# EAGLE design nunchuckUSB-v13 (EAGLE 5.10)
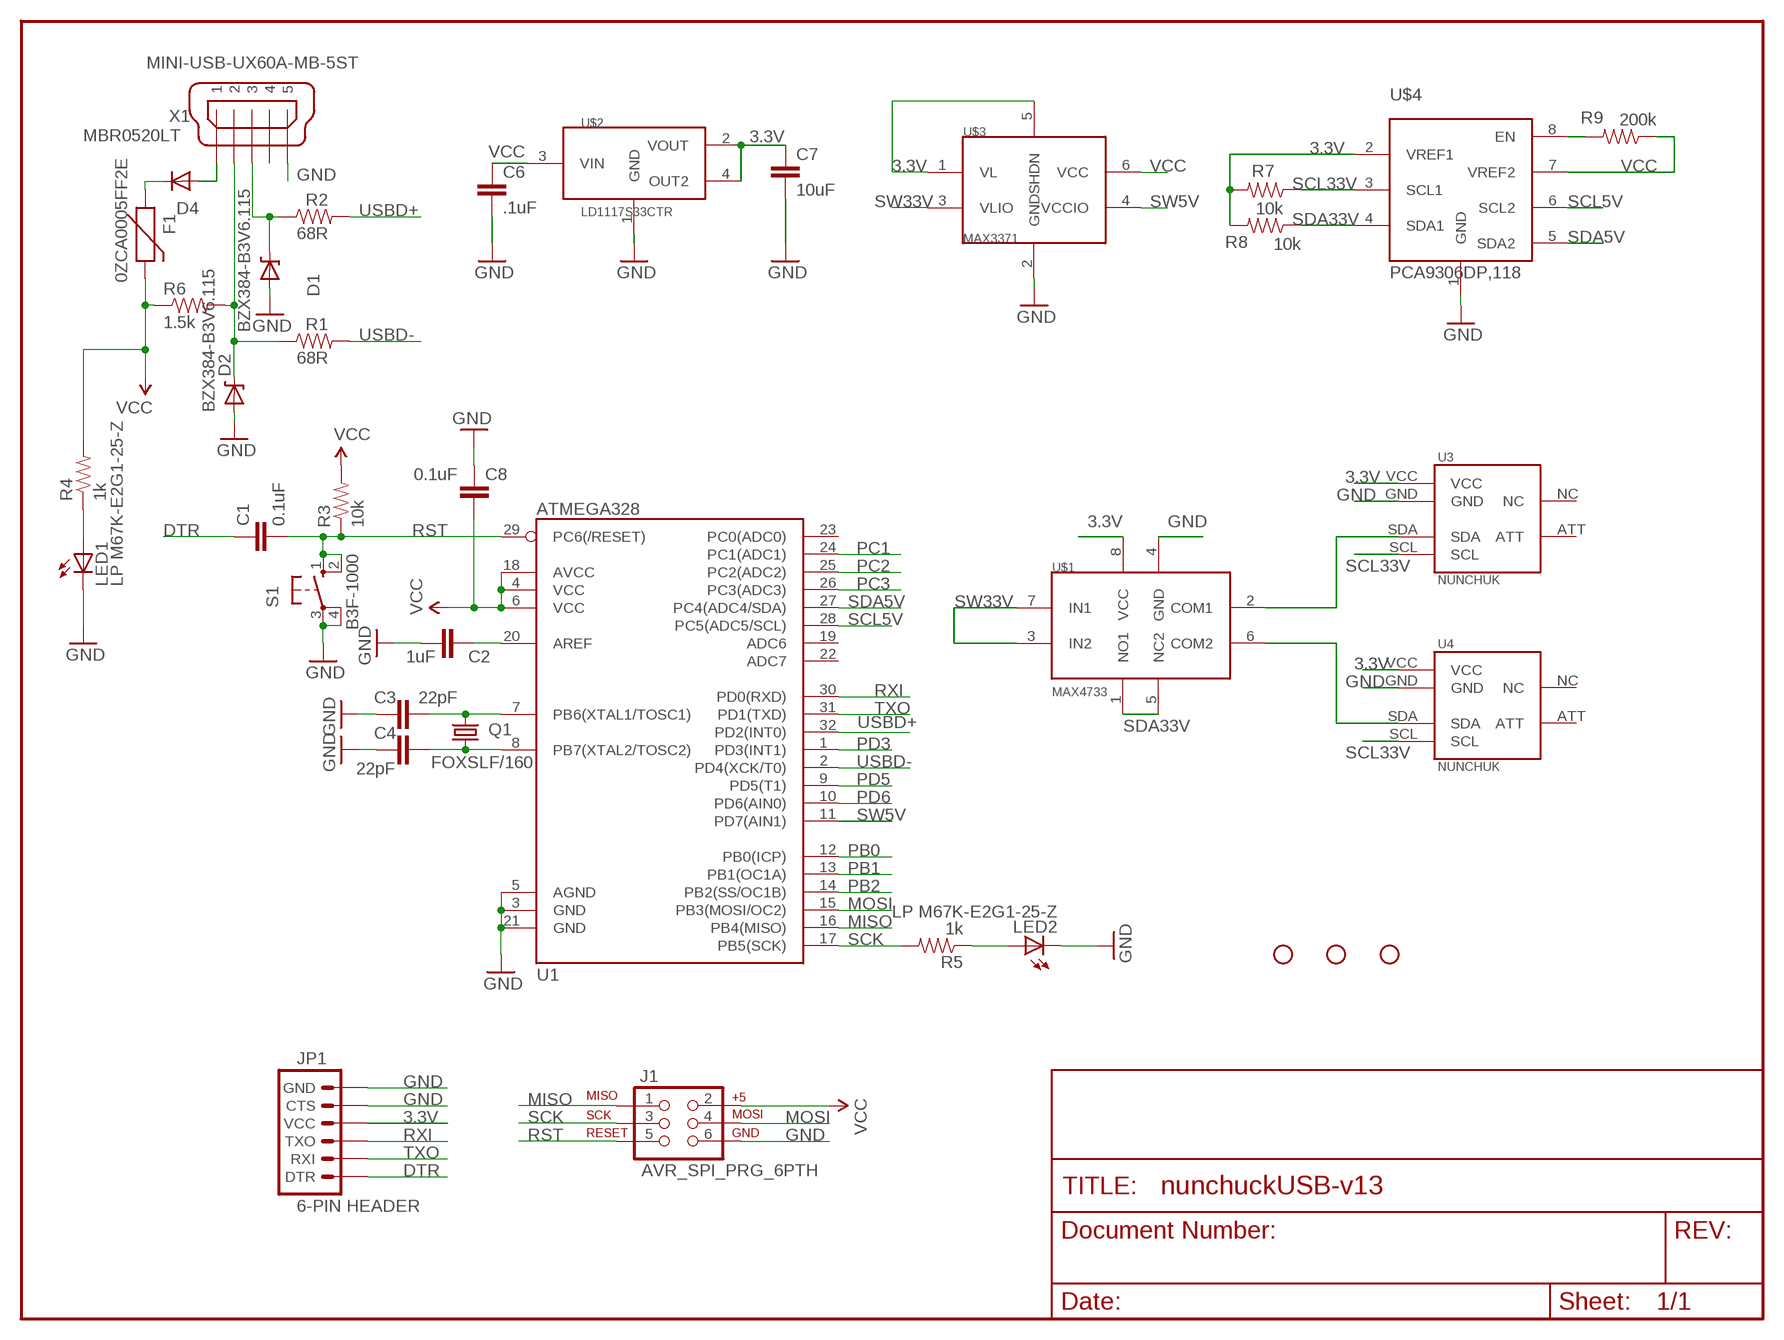
[diagram p0: schematic, sheet 1]

## Parts
C1  0.1uF  CAP0805  [0805]
C2  1uF  CAP0805  [0805]
C3  22pF  CAP0805  [0805]
C4  22pF  CAP0805  [0805]
C6  .1uF  CAP0805  [0805]
C7  10uF  CAP0805  [0805]
C8  0.1uF  CAP0805  [0805]
D1  BZX384-B3V6.115  DIODE-ZENER-BZT52  [SOD-323]
D2  BZX384-B3V6.115  DIODE-ZENER-BZT52  [SOD-323]
D4  MBR0520LT  [SOD123]
F1  0ZCA0005FF2E  PTCSMD  [PTC-1206]
J1  AVR_SPI_PRG_6PTH  [2X3]
JP1  6-PIN HEADER  ARDUINO_SERIAL_PROGRAMPTH  [1X06]
JP2  STAND-OFF  [STAND-OFF]
JP4  STAND-OFF  [STAND-OFF]
JP5  STAND-OFF  [STAND-OFF]
LED1  LP M67K-E2G1-25-Z  LEDCHIPLED_0805  [CHIPLED_0805]
LED2  LP M67K-E2G1-25-Z  LEDCHIPLED_0805  [CHIPLED_0805]
Q1  FOXSLF/160  CRYSTALHC49US  [HC49US]
R1  68R  RESISTOR  [0805]
R2  68R  RESISTOR  [0805]
R3  10k  RESISTOR  [0805]
R4  1k  RESISTOR  [0805]
R5  1k  RESISTOR  [0805]
R6  1.5k  RESISTOR  [0805]
R7  10k  RESISTOR  [0805]
R8  10k  RESISTOR  [0805]
R9  200k  RESISTOR  [0805]
S1  B3F-1000  10-XX  [B3F-10XX]
U1  ATMEGA328  ATMEGA168  [TQFP32-08]
U3  NUNCHUK  [NUNCHUK-TERMINAL]
U4  NUNCHUK  [NUNCHUK-TERMINAL]
U$1  MAX4733  [MSOP8]
U$2  LD1117S33CTR  [SOT223]
U$3  MAX3371  [SC70-6L]
U$4  PCA9306DP,118  [TSSOP8]
X1  MINI-USB-UX60A-MB-5ST  [UX60A-MB-5ST]

## Nets
3.3V: C7.1 JP1.4(VCC) R7.2 R8.2 U3.VCC U4.VCC U$1.8(VCC) U$2.2(VOUT) U$2.4(OUT2) U$3.1(VL) U$3.5(SHDN) U$4.2(VREF1)
DTR: C1.1 JP1.1(DTR)
GND: C2.2 C3.1 C4.1 C6.2 C7.2 C8.1 D1.2(A) D2.2(A) J1.6 JP1.5(CTS) JP1.6(GND) LED1.C LED2.C S1.3(P) S1.4(P1) U1.3(GND) U1.5(AGND) U1.21(GND) U3.GND U4.GND U$1.4(GND) U$2.1(GND) U$3.2(GND) U$4.1(GND) X1.5
MISO: J1.1 U1.16(PB4(MISO))
MOSI: J1.4 U1.15(PB3(MOSI/OC2))
N$1: D4.C F1.1
N$2: C2.1 U1.20(AREF)
N$3: D2.1(C) R1.1 R6.2 X1.2
N$4: D1.1(C) R2.1 X1.3
N$5: C3.2 Q1.2 U1.7(PB6(XTAL1/TOSC1))
N$6: C4.2 Q1.1 U1.8(PB7(XTAL2/TOSC2))
N$7: LED1.A R4.1
N$8: D4.A X1.1
N$9: LED2.A R5.1
N$10: R9.2 U$4.8(EN)
N$16: U3.SDA U$1.2(COM1)
N$17: U4.SDA U$1.6(COM2)
PB0: U1.12(PB0(ICP))
PB1: U1.13(PB1(OC1A))
PB2: U1.14(PB2(SS/OC1B))
PC1: U1.24(PC1(ADC1))
PC2: U1.25(PC2(ADC2))
PC3: U1.26(PC3(ADC3))
PD3: U1.1(PD3(INT1))
PD5: U1.9(PD5(T1))
PD6: U1.10(PD6(AIN0))
RST: C1.2 J1.5 R3.1 S1.1(S) S1.2(S1) U1.29(PC6(/RESET))
RXI: JP1.3(TXO) U1.30(PD0(RXD))
SCK: J1.3 R5.2 U1.17(PB5(SCK))
SCL5V: U1.28(PC5(ADC5/SCL)) U$4.6(SCL2)
SCL33V: R7.1 U3.SCL U4.SCL U$4.3(SCL1)
SDA5V: U1.27(PC4(ADC4/SDA)) U$4.5(SDA2)
SDA33V: R8.1 U$1.1(NO1) U$1.5(NC2) U$4.4(SDA1)
SW5V: U1.11(PD7(AIN1)) U$3.4(VCCIO)
SW33V: U$1.3(IN2) U$1.7(IN1) U$3.3(VLIO)
TXO: JP1.2(RXI) U1.31(PD1(TXD))
USBD+: R2.2 U1.32(PD2(INT0))
USBD-: R1.2 U1.2(PD4(XCK/T0))
VCC: C6.1 C8.2 F1.2 J1.2 R3.2 R4.2 R6.1 R9.1 U1.4(VCC) U1.6(VCC) U1.18(AVCC) U$2.3(VIN) U$3.6(VCC) U$4.7(VREF2)
Unconnected: U1.19(ADC6) U1.22(ADC7) U1.23(PC0(ADC0)) U3.ATT U3.NC U4.ATT U4.NC X1.4

## Library data of the parts
C1-C4 C6-C8 = SparkFun:CAP: Capacitor Standard 0603 ceramic capacitor, and 0.1" leaded capacitor.
D1 D2 = SparkFun:DIODE-ZENER: Zener Diode Production Part - 8199 3.4V Zener Voltage
D4 = diode:MBR0520LT: SCHOTTKY BARRIER RECTIFIER Source: http://onsemi.com .. MBR0520LT1-D.pdf
F1 = SparkFun:PTC: Resettable Fuse PTC Resettable Fuse. Spark Fun Electronics SKU : COM-08357
J1 = SparkFun:AVR_SPI_PRG_6: AVR ISP 6 Pin This is the reduced ISP connector for AVR programming. Common on Arduino. This footprint will take up less PCB space and can be used with a 10-pin to 6-pin adapter such as SKU: BOB-08508
JP1 = SparkFun:ARDUINO_SERIAL_PROGRAM
JP2 JP4 JP5 = SparkFun:STAND-OFF: Stand Off This is the mechanical footprint for a #4 phillips button head screw. Use the keepout ring to avoid running the screw head into surrounding components. SKU : PRT-00447
LED1 LED2 = led:LED: LED OSRAM: - CHIPLED LG R971, LG N971, LY N971, LG Q971, LY Q971, LO R971, LY R971 LH N974, LH R974 LS Q976, LO Q976, LY Q976 LO Q996 - Hyper CHIPLED LW Q18S LB Q993, LB Q99A, LB R99A - SideLED LS A670, LO A670, LY A670, LG A670, LP A670 LB A673, LV A673, LT A673, LW A673 LH A674 LY A675 LS A676, LA A676, LO A676, LY A676, LW A676 LS A679, LY A679, LG A679 - Hyper Micro SIDELED® LS Y876, LA Y876, LO Y876, LY Y876 LT Y87S - SmartLED LW L88C, LW L88S LB L89C, LB L89S, LG L890 LS L89K, LO L89K, LY L89K LS L896, LA L896, LO L896, LY L896 - TOPLED LS T670, LO T670, LY T670, LG T670, LP T670 LSG T670, LSP T670, LSY T670, LOP T670, LYG T670 LG T671, LOG T671, LSG T671 LB T673, LV T673, LT T673, LW T673 LH T674 LS T676, LA T676, LO T676, LY T676, LB T676, LH T676, LSB T676, LW T676 LB T67C, LV T67C, LT T67C, LS T67K, LO T67K, LY T67K, LW E67C LS E67B, LA E67B, LO E67B, LY E67B, LB E67C, LV E67C, LT E67C LW T67C LS T679, LY T679, LG T679 LS T770, LO T770, LY T770, LG T770, LP T770 LB T773, LV T773, LT T773, LW T773 LH T774 LS E675, LA E675, LY E675, LS T675 LS T776, LA T776, LO T776, LY T776, LB T776 LHGB T686 LT T68C, LB T68C - Hyper Mini TOPLED® LB M676 - Mini TOPLED Santana® LG M470 LS M47K, LO M47K, LY M47K Source: http://www.osram.convergy.de LUXEON: - LUMILED® LXK2-PW12-R00, LXK2-PW12-S00, LXK2-PW14-U00, LXK2-PW14-V00 LXK2-PM12-R00, LXK2-PM12-S00, LXK2-PM14-U00 LXK2-PE12-Q00, LXK2-PE12-R00, LXK2-PE12-S00, LXK2-PE14-T00, LXK2-PE14-U00 LXK2-PB12-K00, LXK2-PB12-L00, LXK2-PB12-M00, LXK2-PB14-N00, LXK2-PB14-P00, LXK2-PB14-Q00 LXK2-PR12-L00, LXK2-PR12-M00, LXK2-PR14-Q00, LXK2-PR14-R00 LXK2-PD12-Q00, LXK2-PD12-R00, LXK2-PD12-S00 LXK2-PH12-R00, LXK2-PH12-S00 LXK2-PL12-P00, LXK2-PL12-Q00, LXK2-PL12-R00 Source: www.luxeon.com KINGBRIGHT: KA-3528ASYC Source: www.kingbright.com
Q1 = SparkFun:CRYSTAL: Crystals Various standard crystals. Proven footprints. Spark Fun Electronics SKU : COM-00534
R1-R9 = SparkFun:RESISTOR: Resistor Basic schematic elements and footprints for 0603, 1206, and PTH 1/10th watt (small) resistors.
S1 = switch-omron:10-XX: OMRON SWITCH
U1 = SparkFun:ATMEGA168
U3 U4 = DSanchez:NUNCHUK
U$1 = DSanchez:MAX4733
U$2 = DSanchez:LD1117S33CTR
U$3 = DSanchez:MAX3371
U$4 = DSanchez:PCA9306DP,118
X1 = con-hirose:MINI-USB-: MINI USB Connector Source: http://www.hirose.co.jp/cataloge_hp/e24000019.pdf

## Board
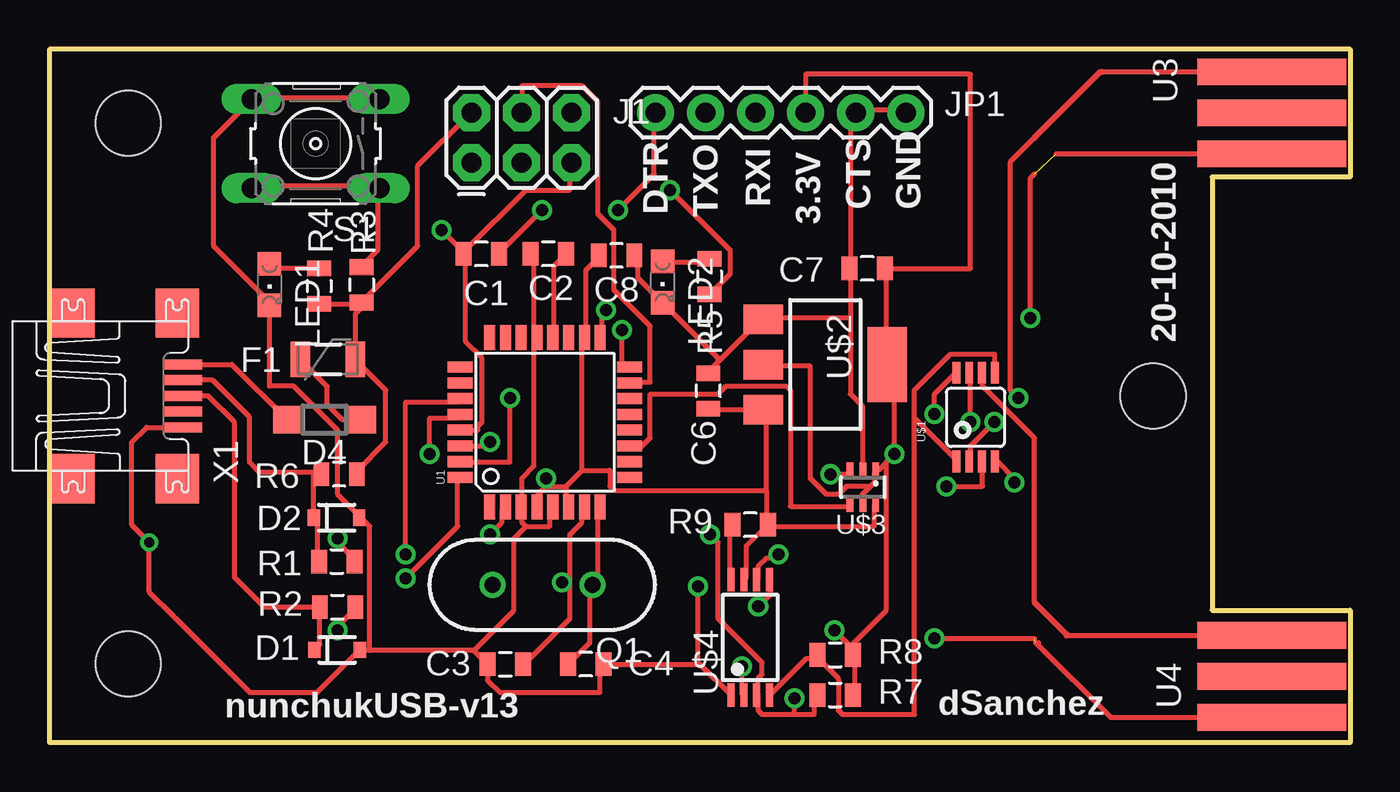
[diagram p1: board, top side]
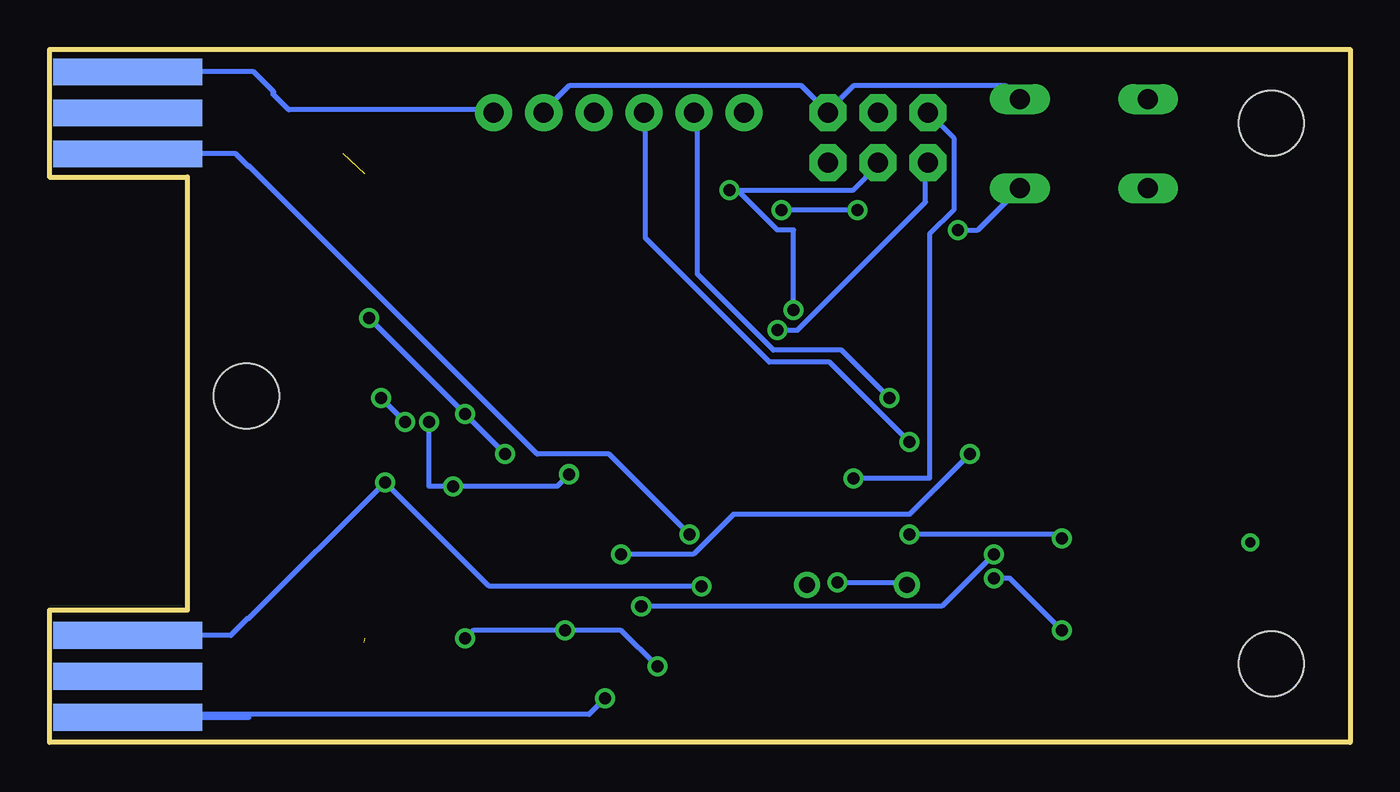
[diagram p2: board, bottom side, seen from below]

Size 66 x 35.18 mm. Coordinates in mm from the lower left corner, seen from the top.
Outline: 0,0 66,0 66,6.71 59,6.71 59,28.7 66,28.7 66,35.18 0,35.18 0,0
Copper layers (1*16): Top 0.035mm / dielectric 1.5mm / Bottom 0.035mm
Design rules "default": minimum track width 10mil, minimum drill 24mil, track to track 8mil, track to pad 8mil, pad to pad 8mil, via to via 8mil, smd to smd 8mil, copper to edge 40mil, drill to drill 8mil, minimum pad ring 10mil, minimum via ring 8mil, stop-mask expansion 4mil, vias tented up to drill 0mil, thermal gap 10mil

### Footprints (pad centres in the part's own frame; a part is rotated, then mirrored left to right if it is on the bottom)
0805 = smd 0.8 x 1.2: 1 -0.9,0; 2 0.9,0
SOD-323 = smd 0.63 x 0.83: 1 -1.15,0; 2 1.15,0
SOD123 = smd 1.4 x 1.4: A 1.9,0; C -1.9,0
PTC-1206 = smd 1 x 1.8: 1 -1.4,0; 2 1.4,0
2X3 = drill 1.016 pad 1.88 octagon: 1 0,0; 2 0,2.54; 3 2.54,0; 4 2.54,2.54; 5 5.08,0; 6 5.08,2.54
1X06 = drill 1.016 pad 1.88 round: 1 0,0; 2 2.54,0; 3 5.08,0; 4 7.62,0; 5 10.16,0; 6 12.7,0
STAND-OFF = hole 3.302: 0,0
CHIPLED_0805 = smd 1.2 x 1.2: A 0,-1.05; C 0,1.05
HC49US = drill 0.813 round: 1 -2.54,0; 2 2.54,0
B3F-10XX = drill 1.016 long: 1 -3.251,2.261; 2 3.251,2.261; 3 -3.251,-2.261; 4 3.251,-2.261
TQFP32-08 = smd 1.27 x 0.559: 1 -4.293,2.8; 2 -4.293,2; 3 -4.293,1.2; 4 -4.293,0.4; 5 -4.293,-0.4; 6 -4.293,-1.2; 7 -4.293,-2; 8 -4.293,-2.8; 17 4.293,-2.8; 18 4.293,-2; 19 4.293,-1.2; 20 4.293,-0.4; 21 4.293,0.4; 22 4.293,1.2; 23 4.293,2; 24 4.293,2.8 | smd 0.559 x 1.27: 9 -2.8,-4.293; 10 -2,-4.293; 11 -1.2,-4.293; 12 -0.4,-4.293; 13 0.4,-4.293; 14 1.2,-4.293; 15 2,-4.293; 16 2.8,-4.293; 25 2.8,4.293; 26 2,4.293; 27 1.2,4.293; 28 0.4,4.293; 29 -0.4,4.293; 30 -1.2,4.293; 31 -2,4.293; 32 -2.8,4.293
NUNCHUK-TERMINAL = smd 7.56 x 1.36: ATT -3.78,0; SDA -3.78,2.08; VCC -3.78,-2.08 | smd 7.56 x 1.36 bottom: GND -3.78,2.08; NC -3.78,0; SCL -3.78,-2.08
MSOP8 = smd 0.4 x 1.1: 1 -0.975,-2.25; 2 -0.325,-2.25; 3 0.325,-2.25; 4 0.975,-2.25; 5 0.975,2.25; 6 0.325,2.25; 7 -0.325,2.25; 8 -0.975,2.25
SOT223 = smd 1.5 x 2: 1 -2.3,-3.15; 2 0,-3.15; 3 2.3,-3.15 | smd 3.8 x 2: 4 0,3.15
SC70-6L = smd 0.35 x 0.8: 1 -0.65,-0.85; 2 0,-0.85; 3 0.65,-0.85; 4 0.65,0.85; 5 0,0.85; 6 -0.65,0.85
TSSOP8 = smd 1.2 x 0.35: 1 -2.925,0.975; 2 -2.925,0.325; 3 -2.925,-0.325; 4 -2.925,-0.975; 5 2.925,-0.975; 6 2.925,-0.325; 7 2.925,0.325; 8 2.925,0.975
UX60A-MB-5ST = smd 2 x 0.5: 1 2.25,1.6; 2 2.25,0.8; 3 2.25,0; 4 2.25,-0.8; 5 2.25,-1.6 | smd 2.2 x 2.5: M1 -3.3,-4.2; M2 -3.3,4.2; M3 2,4.2; M4 2,-4.2

### Placement (x,y rotation side)
C1  21.91,24.79 180 top
C2  25.32,24.8 180 top
C3  23.13,3.97 0 top
C4  27.21,3.97 180 top
C6  33.43,17.84 90 top
C7  41.49,24.06 180 top
C8  28.78,24.72 180 top
D1  14.61,4.7 0 top
D2  14.57,11.41 0 top
D4  13.97,16.38 180 top
F1  14.13,19.44 0 top
J1  21.42,29.42 0 top
JP1  30.75,31.96 0 top
JP2  56,17.59 0 top
JP4  4,31.43 0 top
JP5  4,4 0 top
LED1  11.18,23.24 180 top
LED2  31.11,23.37 180 top
Q1  25.02,8 180 top
R1  14.59,9.18 0 top
R2  14.62,6.87 0 top
R3  15.85,23.22 270 top
R4  13.69,23.16 270 top
R5  33.49,23.64 270 top
R6  14.71,13.62 180 top
R7  39.88,2.41 0 top
R8  39.88,4.45 0 top
R9  35.56,11.05 180 top
S1  13.51,30.39 180 top
U1  25.14,16.25 90 top
U3  65.8,31.95 0 top
U4  65.8,3.35 0 top
U$1  46.99,16.51 0 top
U$2  39.37,19.18 270 top
U$3  41.27,12.95 180 top
U$4  35.56,5.33 90 top
X1  4.5,17.59 0 top

### Tracks (layer width: path | path; a pad name or v marks a point on that pad's centre or on a via)
3.3V  (via drill 0.61)  (2 unrouted)
  Top 0.254: U4.VCC 54.61,1.27 53.85,1.27 50.11,5 | 51.09,29.87 U3.VCC | 50.11,5 50.04,5.08 | 50.11,5 50.19,5.08 | v35.15,3.86 35.15,2.44 U$4.2 | v39.83,5.69 40.64,4.88 | 40.64,4.88 40.64,4.47 R8.2 | R7.2 40.84,2.44 40.84,4.27 R8.2 | v44.91,5.28 49.99,5.28 | 41.66,13.01 41.86,13.21 41.86,13.61 U$3.1 42.06,13.82 42.47,14.22 | 41.66,13.01 41.25,12.6 41.25,12.19 U$3.5 | v44.91,16.66 44.91,17.68 45.92,18.69 U$1.8 | 42.47,14.22 v42.88,14.63 42.88,18.9 42.67,19.1 U$2.4 42.47,19.3 42.47,23.98 C7.1 46.74,24.06 46.74,33.91 38.37,33.91 JP1.4 | 41.66,13.01 40.44,13.01 40.03,12.6 39.42,12.6 38.61,13.41 38.61,19.1 36.37,19.1 U$2.2 | 40.64,4.88 42.47,6.71 42.47,14.22 | 40.64,4.88 R8.2 | 49.99,28.85 49.78,28.65 v49.78,21.54
  Bottom 0.254: v35.15,3.86 36.98,5.69 v39.83,5.69 44.5,5.69 v44.91,5.28 | v42.88,14.63 v44.91,16.66 v49.78,21.54
DTR  (via drill 0.61)
  Top 0.254: v24.99,27.03 22.96,24.99 C1.1 | v28.85,27.03 30.68,28.85 30.68,31.9 JP1.1
  Bottom 0.254: v24.99,27.03 v28.85,27.03
GND  (via drill 0.61)
  Top 0.254: X1.5 4.94,15.99 4.19,15.24 4.19,11.05 5.08,10.16 5.08,7.62 6.35,6.35 10.16,2.54 13.6,2.54 D1.2 16.26,4.7 | 16.26,4.7 21.51,4.7 | 21.51,4.7 C3.1 22.23,3.17 22.86,2.54 27.94,2.54 27.94,3.8 C4.1 32.92,3.97 | 32.92,3.97 33.02,3.97 U$4.1 | v48.97,13.21 48.97,13.41 48.16,14.22 U$1.4 | C2.2 24.59,24.79 24.59,20.73 U1.21 24.59,20.52 24.59,14.02 23.98,13.41 23.98,11.99 U1.3 23.98,11.79 23.98,11.18 24.18,10.97 | 24.18,10.97 25.4,10.97 25.4,11.79 U1.5 | 16.26,4.7 16.26,4.67 16.26,4.7 | 16.26,4.7 16.26,10.97 15.85,11.38 D2.2 15.65,11.58 14.63,12.6 14.63,15.85 12.39,18.09 11.18,18.09 11.18,22.15 LED1.C 11.18,22.35 8.33,25.2 8.33,30.68 10.16,32.51 S1.4 10.36,32.72 16.66,32.72 S1.3 | 24.18,10.97 23.57,10.36 23.57,6.71 21.54,4.67 21.51,4.7 | v32.92,7.92 32.92,4.06 32.92,3.97 | C8.1 29.87,24.59 29.87,23.57 31.09,22.35 LED2.C 31.29,22.15 33.93,19.51 33.93,19.3 | 33.93,19.3 36.17,21.54 U$2.1 36.37,21.54 40.64,21.54 | 33.93,19.3 33.53,18.9 C6.2 | JP1.6 43.28,32.11 41.05,32.11 JP1.5 40.84,31.9 40.64,31.7 40.64,24.18 C7.2 40.64,23.98 40.64,21.54 | 40.64,21.54 40.64,17.68 41.25,17.07 41.25,13.82 U$3.2
  Bottom 0.254: U4.GND 56.8,5.43 55.91,6.33 | 55.91,6.33 55.88,6.35 | U3.GND 55.62,34.03 54.61,33.02 54.66,32.92 53.85,32.11 43.48,32.11 JP1.6 | 55.91,6.33 55.88,6.3 v48.97,13.21 43.69,7.92 v32.92,7.92 | S1.3 16.87,32.72 17.48,33.33 25.2,33.33 26.42,32.11 J1.6 26.62,32.11 27.84,33.33 39.62,33.33 40.84,32.11 JP1.5
MISO  (via drill 0.61)
  Top 0.254: v29.06,20.93 29.06,19.3 29.26,19.1 U1.16
  Bottom 0.254: v29.06,20.93 28.04,20.93 21.54,27.43 21.54,29.26 J1.1
MOSI
  Top 0.254: U1.15 29.46,18.29 30.48,18.29 30.48,21.13 28.65,22.96 28.65,26.01 27.84,26.82 27.84,32.51 27.03,33.33 23.98,33.33 23.98,32.11 J1.4
N$1
  Top 0.254: D4.C 14.86,16.38 14.1,17.14 14.1,18.08 F1.1
N$2
  Top 0.254: C2.1 25.6,24.18 25.6,20.73 U1.20
N$3
  Top 0.254: X1.2 8.28,18.39 10.16,16.51 10.16,14.22 10.67,13.72 13.71,13.72 R6.2 13.41,13.61 13.41,11.58 D2.1 13.61,11.38 13.61,9.35 R1.1
N$4
  Top 0.254: X1.3 8.06,17.59 9.4,16.26 9.4,8.38 10.92,6.86 13.71,6.86 R2.1 13.72,4.97 D1.1
N$5  (via drill 0.61)
  Top 0.254: 26.42,8.13 26.42,10.57 27.03,11.18 27.03,11.79 U1.7 | 26.42,8.13 26.42,6.3 24.18,4.06 C3.2 | 26.42,8.13 v26.01,8.13
  Bottom 0.254: v26.01,8.13 22.55,8.13 Q1.2
N$6
  Top 0.254: C4.2 26.42,4.06 27.43,5.08 27.43,7.92 Q1.1 27.64,8.13 27.84,8.33 27.84,11.79 U1.8
N$7
  Top 0.254: R4.1 11.4,24.07 LED1.A
N$8
  Top 0.254: X1.1 9.26,19.19 D4.A
N$9
  Top 0.254: LED2.A 31.29,24.38 33.33,24.38 R5.1
N$10
  Top 0.254: U$4.8 34.54,8.33 34.54,10.97 R9.2
N$11  (via drill 0.51)
  other vias: 5.08,10.16
N$16  (via drill 0.61)
  Top 0.254: 53.45,34.03 U3.SDA | v47.95,16.26 46.74,15.04 46.74,14.43 U$1.2 | v49.17,17.48 48.77,17.88 48.77,29.46 49.99,30.68
  Top 0.305: 49.99,30.68 53.33,34.03 53.45,34.03
  Bottom 0.254: v47.95,16.26 v49.17,17.48
N$17
  Top 0.254: 51.6,5.43 U4.SDA | 49.99,7.11 49.99,15.44 47.35,18.09 47.35,18.69 U$1.6
  Top 0.305: 49.99,7.11 51.6,5.5 51.6,5.43
RST  (via drill 0.61)
  Top 0.254: R3.1 15.85,24.18 16.66,24.99 16.66,28.04 S1.1 16.66,28.25 10.36,28.25 S1.2 | C1.2 21.13,24.99 24.18,28.04 26.42,28.04 26.42,29.26 J1.5 | U1.29 20.93,15.85 21.74,15.85 21.74,16.05 21.95,16.26 21.95,19.51 21.13,20.32 21.13,24.79 C1.2 | v19.91,26.01 20.93,24.99 C1.2
  Bottom 0.254: v19.91,26.01 18.9,26.01 16.87,28.04 S1.1
RXI  (via drill 0.61)
  Top 0.254: v22.35,15.24 22.35,15.04 20.93,15.04 U1.30
  Bottom 0.254: v22.35,15.24 26.42,19.3 29.46,19.3 35.76,25.6 35.76,31.9 JP1.3
SCK  (via drill 0.61)
  Top 0.254: v31.5,28.04 34.54,24.99 34.54,23.77 33.53,22.76 R5.2 | v28.25,21.95 28.04,21.74 28.04,20.73 U1.17
  Bottom 0.254: 31.09,28.04 25.2,28.04 23.98,29.26 J1.3 | 31.09,28.04 v31.5,28.04 31.09,28.04 | v28.25,21.95 28.25,26.01 29.06,26.01 31.09,28.04
SCL5V  (via drill 0.61)
  Top 0.254: U$4.6 35.97,8.33 35.97,8.94 36.37,9.35 36.98,9.35 v36.98,9.55 | v19.3,14.63 19.3,16.46 20.73,16.46 U1.28
  Bottom 0.254: v19.3,14.63 22.35,11.58 31.29,11.58 33.33,9.55 v36.98,9.55
SCL33V  (via drill 0.61)
  Top 0.254: 37.8,1.42 38.81,1.42 38.81,2.23 R7.1 | 37.8,1.42 36.17,1.42 35.97,1.63 35.97,2.23 U$4.3 35.97,2.44 35.97,3.25 36.17,3.45 36.17,4.06 33.93,6.3 33.93,10.16 v33.53,10.57 | 37.8,1.42 v37.8,2.23
  Bottom 0.254: 55.88,1.27 U4.SCL 61.98,1.42 38.61,1.42 v37.8,2.23 | U3.SCL 56.54,29.87 55.91,29.23 | 55.91,29.23 55.88,29.21 | v33.53,10.57 37.59,14.63 41.25,14.63 55.88,29.26 55.91,29.23
SDA5V  (via drill 0.61)
  Top 0.254: 36.58,8.13 U$4.5 36.58,8.13 | v18.09,9.55 18.09,17.27 20.73,17.27 U1.27 | v35.97,6.91 36.58,7.52 36.58,8.13
  Bottom 0.254: v18.09,9.55 20.73,6.91 v35.97,6.91
SDA33V
  Top 0.254: U$4.4 36.58,2.44 38.41,4.27 38.81,4.27 R8.1 39.01,4.27 40.03,3.25 40.03,1.63 40.23,1.42 43.89,1.42 43.89,16.46 | 43.89,16.46 45.92,14.43 U$1.1 | 43.89,16.46 43.89,17.88 45.72,19.71 47.95,19.71 47.95,18.9 U$1.5
SW5V
  Top 0.254: U$3.4 40.64,11.99 37.59,11.99 37.59,17.88 37.39,18.09 34.34,18.09 33.93,17.68 30.48,17.68 30.48,15.44 30.07,15.04 29.46,15.04 U1.11
SW33V  (via drill 0.61)
  Top 0.254: v39.62,13.61 40.64,13.61 U$3.3 | v45.52,13.01 47.35,13.01 47.35,14.22 U$1.3 | v46.74,16.26 46.74,18.69 U$1.7
  Bottom 0.254: v39.62,13.61 40.23,13.01 v45.52,13.01 46.74,13.01 v46.74,16.26
TXO  (via drill 0.61)
  Top 0.254: v23.37,17.48 23.37,14.22 20.93,14.22 U1.31
  Bottom 0.254: v23.37,17.48 25.81,19.91 29.26,19.91 33.12,23.77 33.12,31.9 JP1.2
USBD+  (via drill 0.61)
  Top 0.254: v14.63,5.69 14.63,5.89 15.44,6.71 R2.2 | v18.09,8.33 20.73,10.97 20.73,13.41 U1.32
  Bottom 0.254: v14.63,5.69 17.27,8.33 v18.09,8.33
USBD-  (via drill 0.61)
  Top 0.254: v14.63,10.36 14.63,10.16 15.44,9.35 R1.2 | v22.35,10.57 22.96,11.18 22.96,11.79 U1.2
  Bottom 0.254: v14.63,10.36 14.83,10.57 v22.35,10.57
VCC  (via drill 0.61)
  Top 0.254: 15.85,22.23 13.73,22.23 R4.2 | 15.85,22.23 16,22.23 15.53,21.76 F1.2 15.65,19.3 17.07,17.88 17.07,15.24 15.65,13.82 R6.1 | 15.85,22.23 15.85,22.15 R3.2 15.85,22.35 18.69,25.2 18.69,29.26 21.34,31.9 J1.2 | 25.2,13.01 24.79,12.6 24.79,11.99 U1.4 | 25.2,13.01 26.21,13.01 | 26.21,13.01 26.21,11.99 U1.6 | C8.2 27.84,24.59 27.23,23.98 27.23,20.73 U1.18 27.03,20.52 27.03,13.82 | 26.21,13.01 27.03,13.82 | C6.1 33.53,16.87 36.17,16.87 U$2.3 36.37,16.87 36.37,12.8 | U$4.7 35.36,8.33 35.36,9.96 36.37,10.97 R9.1 | U$3.6 41.86,11.99 41.86,10.97 36.58,10.97 R9.1 | 36.37,12.8 36.37,11.18 R9.1 | 27.03,13.82 28.45,13.82 28.45,13.01 28.65,12.8 36.37,12.8 | v25.2,13.41 25.2,13.01
  Bottom 0.254: v25.2,13.41 21.34,13.41 21.34,25.81 20.12,27.03 20.12,30.68 21.34,31.9 J1.2

### Text on the board
tPlace: DTR | TXO | RXI | CTS | GND | 3.3V | 20-10-2010 | nunchukUSB-v13 | dSanchez